# Altium project MAX14871_DC_Motor_Driver.PrjPcb (part 2 of 3)
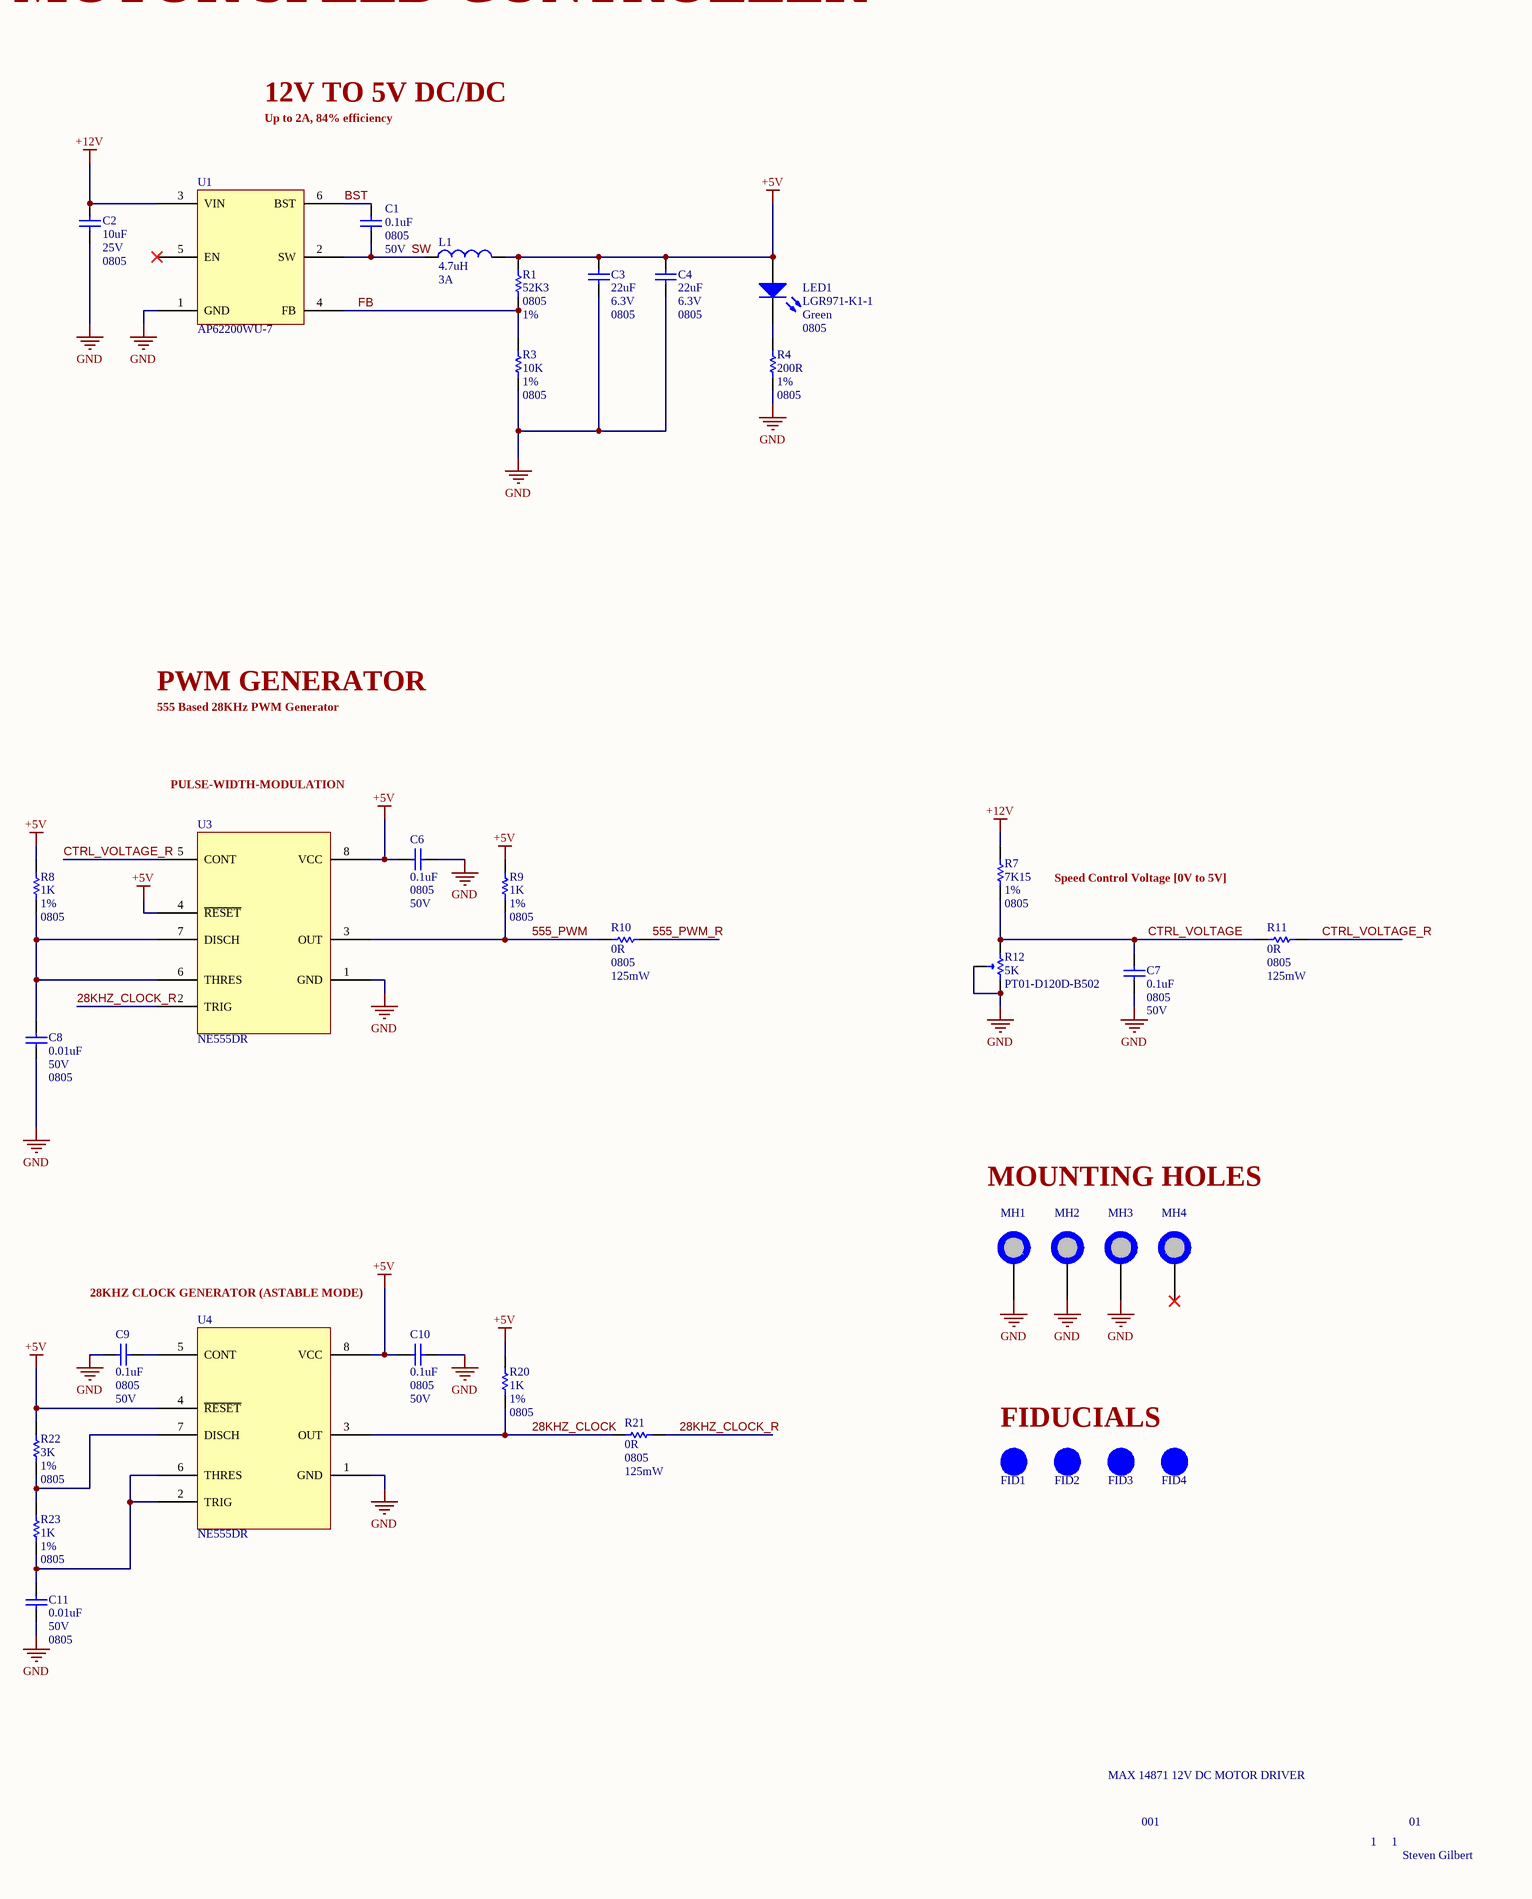
[diagram p2: 14871_Schematic.SchDoc, right]

## Sheet 14871_Schematic.SchDoc (continued)
### Library data of the parts
C1 C6 C7 C9 C10 = 08055C104KAT2A: CAP CER 0.1UF X7R 50V 0805  +/-10%; 50WVDC; SMD; 2.5% Df; 0.037IN. ,; Manufacturer: Kyocera AVX; Dielectric Material: Ceramic; Capacitance: 100nF; Tolerance: 10%; Insulation Resistance: 100GR; Supplier 1: Digi-Key; Manufacturer Part Number: 08055C104KAT2A; RoHS: Yes; Category: Ceramic Capacitors; Stock 1: 12454485; Pricing 1: 1=0.10000, 10=0.06700, 50=0.03640, 100=0.02970, 500=0.02120, 1000=0.01666 (USD); Mount: Surface Mount,PCB; Case/Package: 0805; Number of Pins: 2; Case Code (Metric): 2012; Weight: 0.001411oz; Min Operating Temperature: -55°C; Max Operating Temperature: 125°C; Dielectric: X7R; Packaging: Cut Tape; Voltage Rating: 50V; Package Quantity: 4000; Termination: Standard; Voltage: 50V; Series: MLCC X7R; Dissipation Factor: 2.5%; Length: 2mm; Width: 1.2mm; Height: 0.5mm; Depth: 1.25mm; Thickness: 0.037inch; Radiation Hardening: No; Reach SVHC Compliant: Yes; Lead Free: Lead Free; RoHS Compliant: Yes; ComponentLink1URL: https://datasheet.ciiva.com/19475/2009691-19475858.pdf?src-supplier=Jameco; ComponentLink1Description: https://datasheet.ciiva.com/19475/2009691-19475858.pdf?src-supplier=Jameco; ComponentLink2URL: https://datasheet.ciiva.com/11786/0900766b802d4698-11786116.pdf?src-supplier=RSComponents; ComponentLink2Description: https://datasheet.ciiva.com/11786/0900766b802d4698-11786116.pdf?src-supplier=RSComponents; ComponentLink3URL: https://datasheet.ciiva.com/2988/cx7r-2988014.pdf?src-supplier=Avnet; ComponentLink3Description: https://datasheet.ciiva.com/2988/cx7r-2988014.pdf?src-supplier=Avnet; ComponentLink4URL: https://datasheet.ciiva.com/16199/cx7r-16199014.pdf?src-supplier=Future+Electronics; ComponentLink4Description: https://datasheet.ciiva.com/16199/cx7r-16199014.pdf?src-supplier=Future+Electronics; ComponentLink5URL: https://datasheet.ciiva.com/11504/cx7r-11504044.pdf?src-supplier=Avnet; ComponentLink5Description: https://datasheet.ciiva.com/11504/cx7r-11504044.pdf?src-supplier=Avnet; ComponentLink6URL: https://datasheet.ciiva.com/150/cx7r-150258.pdf?src-supplier=Digi-Key; ComponentLink6Description: https://datasheet.ciiva.com/150/cx7r-150258.pdf?src-supplier=Digi-Key; ComponentLink7URL: https://datasheet.ciiva.com/150/cx7r-150257.pdf?src-supplier=Digi-Key; ComponentLink7Description: https://datasheet.ciiva.com/150/cx7r-150257.pdf?src-supplier=Digi-Key; ComponentLink8URL: https://datasheet.ciiva.com/150/cx7r-150259.pdf?src-supplier=Digi-Key; ComponentLink8Description: https://datasheet.ciiva.com/150/cx7r-150259.pdf?src-supplier=Digi-Key; ComponentLink9URL: https://datasheet.ciiva.com/7812/cx7r-7812079.pdf?src-supplier=Element14; ComponentLink9Description: https://datasheet.ciiva.com/7812/cx7r-7812079.pdf?src-supplier=Element14; ComponentLink10URL: https://datasheet.ciiva.com/5416/cx7r-5416959.pdf?src-supplier=Mouser; ComponentLink10Description: https://datasheet.ciiva.com/5416/cx7r-5416959.pdf?src-supplier=Mouser; Supplier Part Number 1: 478-1395-1-ND
C2 = GRM21BR61E106KA73L: CAP CER 10UF 25V X5R 0805; Manufacturer: Murata; Material: Ceramic; Tolerance: 10%; Supplier 1: Digi-Key; Manufacturer Part Number: GRM21BR61E106KA73L; RoHS: Yes; Category: Ceramic Capacitors; Stock 1: 4346659; Pricing 1: 1=0.25000, 10=0.17500, 50=0.11640, 100=0.09890, 500=0.06984, 1000=0.06111 (USD); Mount: Surface Mount; Case Code (Metric): 2012; Case Code (Imperial): 0805; Min Operating Temperature: -55°C; Max Operating Temperature: 85°C; Capacitance: 10uF; Dielectric: X5R; Package Quantity: 1; Voltage Rating: 25V; Packaging: Tape and Reel; Termination: SMD/SMT; Voltage: 25V; Series: GRM; Construction: Flat; Length: 2mm; Width: 0.049inch; Height: 1.25mm; Thickness: 0.053inch; Depth: 1.25mm; Radiation Hardening: No; Reach SVHC Compliant: Yes; Lead Free: Lead Free; RoHS Compliant: Yes; ComponentLink1URL: https://datasheet.ciiva.com/22774/1747469-22774396.pdf?src-supplier=Farnell; ComponentLink1Description: https://datasheet.ciiva.com/22774/1747469-22774396.pdf?src-supplier=Farnell; ComponentLink2URL: https://datasheet.ciiva.com/28584/626718-28584288.pdf?src-supplier=Element14; ComponentLink2Description: https://datasheet.ciiva.com/28584/626718-28584288.pdf?src-supplier=Element14; ComponentLink3URL: https://datasheet.ciiva.com/5424/product-5424327.pdf?src-supplier=Mouser; ComponentLink3Description: https://datasheet.ciiva.com/5424/product-5424327.pdf?src-supplier=Mouser; ComponentLink4URL: https://datasheet.ciiva.com/16440/grm21br61e106ka73l-16440627.pdf?src-supplier=Future+Electronics; ComponentLink4Description: https://datasheet.ciiva.com/16440/grm21br61e106ka73l-16440627.pdf?src-supplier=Future+Electronics; ComponentLink5URL: https://datasheet.ciiva.com/29199/454623-da-01-en-vs-kondensator-0805-29199615.pdf?src-supplier=Conrad; ComponentLink5Description: https://datasheet.ciiva.com/29199/454623-da-01-en-vs-kondensator-0805-29199615.pdf?src-supplier=Conrad; ComponentLink6URL: https://datasheet.ciiva.com/14116/grmseries-highdielectrictype-eng-14116376.pdf?src-supplier=Distrelec; ComponentLink6Description: https://datasheet.ciiva.com/14116/grmseries-highdielectrictype-eng-14116376.pdf?src-supplier=Distrelec; ComponentLink7URL: https://datasheet.ciiva.com/7719/1747469-7719093.pdf?src-supplier=Element14; ComponentLink7Description: https://datasheet.ciiva.com/7719/1747469-7719093.pdf?src-supplier=Element14; ComponentLink8URL: https://datasheet.ciiva.com/28584/626718-28584279.pdf?src-supplier=Element14; ComponentLink8Description: https://datasheet.ciiva.com/28584/626718-28584279.pdf?src-supplier=Element14; ComponentLink9URL: https://datasheet.ciiva.com/139/partnumbering-e-01-139183.pdf?src-supplier=Digi-Key; ComponentLink9Description: https://datasheet.ciiva.com/139/partnumbering-e-01-139183.pdf?src-supplier=Digi-Key; ComponentLink10URL: https://datasheet.ciiva.com/139/partnumbering-e-01-139182.pdf?src-supplier=Digi-Key; ComponentLink10Description: https://datasheet.ciiva.com/139/partnumbering-e-01-139182.pdf?src-supplier=Digi-Key; ComponentLink11URL: https://datasheet.ciiva.com/139/partnumbering-e-01-139184.pdf?src-supplier=Digi-Key; ComponentLink11Description: https://datasheet.ciiva.com/139/partnumbering-e-01-139184.pdf?src-supplier=Digi-Key; Supplier Part Number 1: 490-5523-1-ND
C3 C4 = CL21A226MQQNNNG: CAP CER 6.3V X5R 20% SMD 0805 85°C Embossed T/R; Manufacturer: Samsung; Material: Ceramic; Supplier 1: Digi-Key; Manufacturer Part Number: CL21A226MQQNNNG; RoHS: Yes; Category: Ceramic Capacitors; Stock 1: 1010294; Pricing 1: 1=0.13000, 10=0.09300, 50=0.05300, 100=0.04380, 500=0.03074, 1000=0.02545 (USD); Mount: Surface Mount; Case Code (Metric): 2012; Min Operating Temperature: -55°C; Max Operating Temperature: 85°C; Tolerance: 20%; Packaging: Tape and Reel; Package Quantity: 3000; Dielectric: X5R; Voltage: 6.3V; Series: CL; Construction: Flat; Length: 2mm; Width: 0.049inch; Height: 1.25mm; Thickness: 0.055inch; Depth: 1.25mm; Radiation Hardening: No; RoHS Compliant: Yes; ComponentLink1URL: https://datasheet.ciiva.com/25728/cl21a226mqqnnng-25728680.pdf?src-supplier=Digi-Key; ComponentLink1Description: https://datasheet.ciiva.com/25728/cl21a226mqqnnng-25728680.pdf?src-supplier=Digi-Key; ComponentLink2URL: https://datasheet.ciiva.com/29199/454647-da-01-en-vs-kondensator-0805-29199620.pdf?src-supplier=Conrad; ComponentLink2Description: https://datasheet.ciiva.com/29199/454647-da-01-en-vs-kondensator-0805-29199620.pdf?src-supplier=Conrad; Supplier Part Number 1: 1276-6460-1-ND; Capacitance: 22uF; Case Code (Imperial): 0805
C5 C12 = 0805DC105KAT2A: Cap Cer 1UF 35V X7R 0805; Manufacturer: Kyocera AVX; Supplier 1: Digi-Key; Manufacturer Part Number: 0805DC105KAT2A; RoHS: Yes; Category: Ceramic Capacitors; Stock 1: 25687; Pricing 1: 1=0.22000, 10=0.15100, 50=0.09040, 100=0.07640, 500=0.05226, 1000=0.04623 (USD); Packaging: Tape and Reel; ComponentLink1URL: http://www.mouser.com/ds/2/40/X7RDielectric-777024.pdf?src-supplier=Mouser; ComponentLink1Description: http://www.mouser.com/ds/2/40/X7RDielectric-777024.pdf?src-supplier=Mouser; Supplier Part Number 1: 478-0805DC105KAT2ACT-ND; Rating: 35V
C8 C11 = C0805C103K5RACTU: CAP CER 0.01uF 50V X7R 10% SMD 0805 125C Plastic T/R; Manufacturer: KEMET; Capacitance: 10nF; Supplier 1: Digi-Key; Manufacturer Part Number: C0805C103K5RACTU; RoHS: Yes; Category: Ceramic Capacitors; Stock 1: 3238718; Pricing 1: 1=0.11000, 10=0.07500, 50=0.04260, 100=0.03530, 500=0.02476, 1000=0.02050 (USD); Mount: Surface Mount; Case Code (Imperial): 0805; Case Code (Metric): 2012; Contact Plating: Tin,Matte; Min Operating Temperature: -55°C; Max Operating Temperature: 125°C; Tolerance: 10%; Dielectric: X7R; Packaging: Tape and Reel; Voltage Rating (DC): 50V; Package Quantity: 4000; Termination: SMD/SMT; Voltage: 50V; Construction: Flat; Length: 2mm; Width: 1.2mm; Height: 0.78mm; Depth: 1.25mm; Lead Pitch: 0.75mm; Radiation Hardening: No; ComponentLink1URL: http://www.farnell.com/datasheets/2740682.pdf?src-supplier=Farnell; ComponentLink1Description: http://www.farnell.com/datasheets/2740682.pdf?src-supplier=Farnell; ComponentLink2URL: http://www.onlinecomponents.com/productFiles/mf-KEM/kem_c1002_x7r_smd.pdf?src-supplier=Onlinecomponents.com; ComponentLink2Description: http://www.onlinecomponents.com/productFiles/mf-KEM/kem_c1002_x7r_smd.pdf?src-supplier=Onlinecomponents.com; ComponentLink3URL: https://www.verical.com/server-webapp/html/getDatasheet?partID=293414&src-supplier=Verical; ComponentLink3Description: https://www.verical.com/server-webapp/html/getDatasheet?partID=293414&src-supplier=Verical; ComponentLink4URL: http://www.farnell.com/datasheets/2740682.pdf?src-supplier=Newark; ComponentLink4Description: http://www.farnell.com/datasheets/2740682.pdf?src-supplier=Newark; ComponentLink5URL: http://www.farnell.com/datasheets/2740682.pdf?src-supplier=Element14; ComponentLink5Description: http://www.farnell.com/datasheets/2740682.pdf?src-supplier=Element14; ComponentLink6URL: https://api.kemet.com/component-edge/download/datasheet/C0805C103K5RACTU.pdf?src-supplier=Digi-Key; ComponentLink6Description: https://api.kemet.com/component-edge/download/datasheet/C0805C103K5RACTU.pdf?src-supplier=Digi-Key; ComponentLink7URL: http://www.kemet.com/Lists/ProductCatalog/Attachments/53/KEM_C1002_X7R_SMD.pdf?src-supplier=Avnet; ComponentLink7Description: http://www.kemet.com/Lists/ProductCatalog/Attachments/53/KEM_C1002_X7R_SMD.pdf?src-supplier=Avnet; Supplier Part Number 1: 399-C0805C103K5RAC7800CT-ND
D1 = BZT52C10-7-F: Vz=10V 9.4V~10.6V Izt=5mA; Manufacturer: Diodes; Max Reverse Leakage Current: 200nA; Element Configuration: Single; Output Current: 50mA; Tolerance: 6%; Forward Voltage: 900mV; Impedance: 20R; Zener Current: 5mA; ESD Protection: No; Supplier 1: Digi-Key; RoHS: Yes; Category: Zener Diodes; Stock 1: 627176; Pricing 1: 1=0.22000, 10=0.19900, 100=0.10830, 500=0.06662, 1000=0.04542 (USD); Mount: Surface Mount; Number of Pins: 2; Weight: 0.000353oz; Contact Plating: Tin,Matte; Min Operating Temperature: -65°C; Max Operating Temperature: 150°C; Packaging: Tape and Reel; Zener Voltage: 10V; Package Quantity: 3000; Series: -; Voltage Tolerance: 6%; Max Reverse Current: 200nA; Test Current: 5mA; Power Dissipation: 500mW; Working Voltage: 10V; Termination: SMD/SMT; Power Rating: 500mW; Voltage Rating (DC): 10V; Length: 2.85mm; Width: 1.7mm; Height: 1.35mm; Radiation Hardening: No; Lead Free: Lead Free; RoHS Compliant: Yes; ComponentLink1URL: https://datasheet.ciiva.com/15142/getdatasheetpartid-89980-15142547.pdf?src-supplier=Verical; ComponentLink1Description: https://datasheet.ciiva.com/15142/getdatasheetpartid-89980-15142547.pdf?src-supplier=Verical; ComponentLink2URL: https://datasheet.ciiva.com/27052/1539497-27052374.pdf?src-supplier=Jameco; ComponentLink2Description: https://datasheet.ciiva.com/27052/1539497-27052374.pdf?src-supplier=Jameco; Supplier Part Number 1: BZT52C10-FDICT-ND; Manufacturer Part Number: BZT52C10-7-F
D2 = SMF16A-TP: TVS DIODE 16VWM 26VC SOD123FL; Manufacturer: MCC; Direction: Unidirectional; Number of Unidirectional Channels: 1; Min Breakdown Voltage: 17.8V; Clamping Voltage: 26V; Peak Pulse Power: 200W; Power Line Protection: No; Max Breakdown Voltage: 19.7V; Leakage Current: 1uA; Element Configuration: Single; Peak Pulse Current: 7.7A; Diode Type: ZENER; Supplier 1: Digi-Key; Manufacturer Part Number: SMF16A-TP; RoHS: Yes; Stock 1: 30285; Pricing 1: 1=0.43000, 10=0.32600, 100=0.20330, 500=0.13910, 1000=0.10700 (USD); Mount: Surface Mount; Number of Pins: 2; Min Operating Temperature: -65°C; Max Operating Temperature: 175°C; Packaging: Tape and Reel; Package Quantity: 1; Reverse Standoff Voltage: 16V; Power Dissipation: 200W; Resistor Type: Zener; Series: -; Clamping Voltage-Max: 26V; Length: 2.85mm; Depth: 1.8mm; Radiation Hardening: No; Lead Free: Lead Free; RoHS Compliant: Yes; ComponentLink1URL: https://datasheet.ciiva.com/6574/smf5-0170sod-123fl-6574110.pdf?src-supplier=Digi-Key; ComponentLink1Description: https://datasheet.ciiva.com/6574/smf5-0170sod-123fl-6574110.pdf?src-supplier=Digi-Key; ComponentLink2URL: https://datasheet.ciiva.com/6574/smf5-0170sod-123fl-6574111.pdf?src-supplier=Digi-Key; ComponentLink2Description: https://datasheet.ciiva.com/6574/smf5-0170sod-123fl-6574111.pdf?src-supplier=Digi-Key; Supplier Part Number 1: SMF16A-TPMSCT-ND; Working Voltage: 16V
F1 = 0685T3000-01: Fuse Chip 3A 63V Slow Blow 2-Pin T/R; Manufacturer: Bel; Fuse Type: Board Mount (Cartridge Style Excluded); DC Cold Resistance: 54mR; Approvals: CE,cURus; Supplier 1: Digi-Key; Manufacturer Part Number: 0685T3000-01; RoHS: Yes; Category: Fuses; Stock 1: 409603; Pricing 1: 1=0.30000, 5=0.29600, 10=0.28200, 50=0.25180, 100=0.23450, 250=0.20848, 500=0.17372, 1000=0.16503 (USD); Mount: Surface Mount; Case Code (Imperial): 1206; Case Code (Metric): 3216; Min Operating Temperature: -55°C; Max Operating Temperature: 125°C; Packaging: Tape and Reel; Current Rating: 3A; Voltage Rating (AC): 63V; Voltage Rating (DC): 63V; RoHS Compliant: Yes; ComponentLink1URL: https://belfuse.com/resources/datasheets/circuitprotection/ds-cp-c1t-series.pdf?src-supplier=Digi-Key; ComponentLink1Description: https://belfuse.com/resources/datasheets/circuitprotection/ds-cp-c1t-series.pdf?src-supplier=Digi-Key; Supplier Part Number 1: 507-1896-1-ND
FID1-FID4 = FID_1mm: Fiducial 40mil diameter, 120 Mask
J1 J2 = 1935161: Conn PC Terminal Block 2 POS 5mm Solder ST Thru-Hole 17.5A; Manufacturer: Phoenix Contact; Number of Contacts: 2; Max Current Rating: 16A; Max Supply Voltage: 250V; Number of Levels: 1; Current: 18A; Voltage: 300V; Voltage Rating (DC): 320V; Connector Type: Screw; Wire/Cable Gauge: 26AWG; Wire Gauge (Min): 12AWG; Approvals: UL; Supplier 1: Digi-Key; Manufacturer Part Number: 1935161; RoHS: Yes; Category: Terminal Blocks; Stock 1: 238571; Pricing 1: 1=0.54000, 10=0.47200, 50=0.45100, 100=0.43870, 250=0.41000, 500=0.37720, 1000=0.36550 (USD); Mount: Through Hole; Number of Pins: 2; Contact Material: Copper,Tin; Housing Material: Polyamide; Color: Green; Weight: 0.067021oz; Material: Nylon; Housing Color: Green; Insulation Material: Nylon; Current Rating: 17.5A; Number of Rows: 1; Termination: Solder; Orientation: Straight; Voltage Rating: 250V; Package Quantity: 250; Packaging: Bulk; Number of Poles: 2; Number of Positions: 2; Number of Positions Per Level: 2; Number of Circuits: 2; Series: COMBICON PT; Number of Ways: 2; Length: 9mm; Width: 14.9mm; Height: 11.3mm; Wire Gauge (Max): 26AWG; Depth: 9mm; Pitch: 5mm; Radiation Hardening: No; RoHS Compliant: Yes; Lead Free: Lead Free; Flammability Rating: UL94 V-0; ComponentLink1URL: https://datasheet.ciiva.com/16047/1935161-16047247.pdf?src-supplier=Onlinecomponents.com; ComponentLink1Description: https://datasheet.ciiva.com/16047/1935161-16047247.pdf?src-supplier=Onlinecomponents.com; ComponentLink2URL: https://datasheet.ciiva.com/15169/getdatasheetpartid-177903-15169663.pdf?src-supplier=Verical; ComponentLink2Description: https://datasheet.ciiva.com/15169/getdatasheetpartid-177903-15169663.pdf?src-supplier=Verical; ComponentLink3URL: https://datasheet.ciiva.com/824/combiconcompact5-0mmseries-824222.pdf?src-supplier=Digi-Key; ComponentLink3Description: https://datasheet.ciiva.com/824/combiconcompact5-0mmseries-824222.pdf?src-supplier=Digi-Key; Supplier Part Number 1: 277-1667-ND
JP1 = 68000-103HLF: CONN HEADER VERT 3POS 2.54MM
L1 = NR6028T4R7M: Inductor Power Shielded Wirewound 4.7uH 20% 100KHz Ferrite 3A 0.0403Ohm DCR 2424 T/R; Manufacturer: Taiyo Yuden; Self Resonant Frequency: 39MHz; Saturation Current: 2.7A; DC Resistance (DCR): 40.3mR; Supplier 1: Digi-Key; Manufacturer Part Number: NR6028T4R7M; RoHS: Yes; Category: Fixed Inductors; Stock 1: 261825; Pricing 1: 1=0.36000, 10=0.31900, 25=0.27920, 50=0.23940, 100=0.21940, 250=0.19948, 500=0.18750, 1000=0.14362 (USD); Mount: Surface Mount; Case/Package: 2424; Number of Pins: 2; Core Material: Ferrite; Min Operating Temperature: -25°C; Max Operating Temperature: 120°C; Packaging: Tape and Reel; Tolerance: 20%; Inductance Tolerance: 20%; Package Quantity: 2000; Current Rating: 3A; Shielding: Shielded; Resistor Type: Wirewound; Inductance: 4.7uH; Test Frequency: 100kHz; Termination: SMD/SMT; RMS Current (Irms): 3A; Series: NR; Length: 0.236inch; Width: 0.236inch; Height: 2.8mm; Height - Seated (Max): 0.11inch; Depth: 6.2mm; Radiation Hardening: No; Halogen Free: Halogen Free; RoHS Compliant: Yes; Lead Free: Lead Free; ComponentLink1URL: https://datasheet.ciiva.com/7291/nr6028t4r7m-ss-7291638.pdf?src-supplier=Newark; ComponentLink1Description: https://datasheet.ciiva.com/7291/nr6028t4r7m-ss-7291638.pdf?src-supplier=Newark; ComponentLink2URL: https://datasheet.ciiva.com/8502/nr6028t4r7m-ss-8502688.pdf?src-supplier=Avnet; ComponentLink2Description: https://datasheet.ciiva.com/8502/nr6028t4r7m-ss-8502688.pdf?src-supplier=Avnet; ComponentLink3URL: https://datasheet.ciiva.com/15988/314nr6028t4r7m-15988117.pdf?src-supplier=Onlinecomponents.com; ComponentLink3Description: https://datasheet.ciiva.com/15988/314nr6028t4r7m-15988117.pdf?src-supplier=Onlinecomponents.com; ComponentLink4URL: https://datasheet.ciiva.com/1043/wound04-e-1043082.pdf?src-supplier=Digi-Key; ComponentLink4Description: https://datasheet.ciiva.com/1043/wound04-e-1043082.pdf?src-supplier=Digi-Key; ComponentLink5URL: https://datasheet.ciiva.com/1043/wound04-e-1043081.pdf?src-supplier=Digi-Key; ComponentLink5Description: https://datasheet.ciiva.com/1043/wound04-e-1043081.pdf?src-supplier=Digi-Key; ComponentLink6URL: https://datasheet.ciiva.com/1043/wound04-e-1043083.pdf?src-supplier=Digi-Key; ComponentLink6Description: https://datasheet.ciiva.com/1043/wound04-e-1043083.pdf?src-supplier=Digi-Key; ComponentLink7URL: https://datasheet.ciiva.com/4955/wound04-e-4955707.pdf?src-supplier=Mouser; ComponentLink7Description: https://datasheet.ciiva.com/4955/wound04-e-4955707.pdf?src-supplier=Mouser; Supplier Part Number 1: 587-2100-1-ND
LED1 = LGR971-K1-1: LED SMT GREEN 0805; Supplier Part Number 1: 475-1410-1-ND
LED2 = LSR976-NR-1: LED SMT RED 0805; Manufacturer: Osram Opto; Lens Color: White; Forward Current: 25mA; Forward Voltage: 2.5V; Luminous Intensity: 180mcd; Viewing Angle: 160°; Lens Style: Flat,Diffused,Colorless,Rectangular; Test Current: 20mA; Dominant Wavelength: 633nm; Luminous Flux: 0.47lm; Number of Elements: 1; Power Dissipation: 65mW; Reverse Voltage: 12V; Lens Transparency: Diffused; Lens Size: 1.25mm; Supplier 1: Mouser; Manufacturer Part Number: LSR976-NR-1; RoHS: Yes; Category: Uncategorized; Stock 1: 1195318; Pricing 1: 1=0.30000, 10=0.16400, 50=0.16400, 100=0.07700, 500=0.07100, 1000=0.05400, 5000=0.04700, 10000=0.04300, 16000=0.03700 (USD); Mount: Surface Mount; Number of Pins: 2; Color: Red; Case Code (Metric): 2012; Case Code (Imperial): 0805; Min Operating Temperature: -30°C; Max Operating Temperature: 85°C; Packaging: Tape and Reel; Package Quantity: 16000; Number of LEDs: 1; Series: CHIPLED 0805; Length: 2.1mm; Width: 1.25mm; Height: 0.9mm; Depth: 1.35mm; Radiation Hardening: No; RoHS Compliant: Yes; ComponentLink1URL: https://datasheet.ciiva.com/4688/o-ls-ly-r976-24152-4688435.pdf?src-supplier=Mouser; ComponentLink1Description: https://datasheet.ciiva.com/4688/o-ls-ly-r976-24152-4688435.pdf?src-supplier=Mouser; ComponentLink2URL: https://datasheet.ciiva.com/26920/getdatasheetpartid-568367-26920831.pdf?src-supplier=Verical; ComponentLink2Description: https://datasheet.ciiva.com/26920/getdatasheetpartid-568367-26920831.pdf?src-supplier=Verical; ComponentLink3URL: https://datasheet.ciiva.com/2112/00078896-0-2112782.pdf?src-supplier=Digi-Key; ComponentLink3Description: https://datasheet.ciiva.com/2112/00078896-0-2112782.pdf?src-supplier=Digi-Key; ComponentLink4URL: https://datasheet.ciiva.com/2112/00078896-0-2112781.pdf?src-supplier=Digi-Key; ComponentLink4Description: https://datasheet.ciiva.com/2112/00078896-0-2112781.pdf?src-supplier=Digi-Key; ComponentLink5URL: https://datasheet.ciiva.com/2112/00078896-0-2112783.pdf?src-supplier=Digi-Key; ComponentLink5Description: https://datasheet.ciiva.com/2112/00078896-0-2112783.pdf?src-supplier=Digi-Key; Supplier Part Number 1: 720-LSR976-NR-1
LINK1 = QPC02SXGN-RC: 2 Position 2.54 mm Centerline Single Circuit Open Top Jumper; Manufacturer: Sullins; Number of Positions: 2; Pitch: 0.1inch; Supplier 1: Digi-Key; Manufacturer Part Number: QPC02SXGN-RC; RoHS: Yes; Category: Connectors; Stock 1: 1015861; Pricing 1: 1=0.10000, 10=0.05000, 25=0.04080, 50=0.03780, 100=0.03650, 250=0.03152, 500=0.03024, 2000=0.02520, 4000=0.02394 (USD); Case/Package: 100; Contact Plating: Gold; Package Quantity: 2000; Packaging: Bulk; Height: 0.235inch; RoHS Compliant: Yes; Lead Free: Lead Free; ComponentLink1URL: https://datasheet.ciiva.com/767/284-sxgn-11510-767869.pdf?src-supplier=Digi-Key; ComponentLink1Description: https://datasheet.ciiva.com/767/284-sxgn-11510-767869.pdf?src-supplier=Digi-Key; Supplier Part Number 1: S9337-ND
MH1-MH3 = MH_7.4MMC_3.2MMD: Mounting Hole 7.4mm Diameter, 3.2mm Drill
MH4 = MH_7.4MMNC_3.2MMD: Hole 7.4MM Diameter (Non Copper), 3.2mm Drill NPTH
Q1 = AOD413A: MOSFET P-CH 40V 12A TO252; Manufacturer: Alpha & Omega Semiconductor; Rds On Max: 44mR; Input Capacitance: 1.125nF; Max Power Dissipation: 50W; Number of Elements: 1; Gate to Source Voltage (Vgs): 20V; Supplier 1: Digi-Key; Manufacturer Part Number: AOD413A; RoHS: Yes; Category: MOSFETs; Stock 1: 406428; Pricing 1: 1=0.61000, 10=0.54100, 100=0.41440, 500=0.32760, 1000=0.26208 (USD); Mount: Surface Mount; Number of Pins: 3; Min Operating Temperature: -55°C; Max Operating Temperature: 175°C; Package Quantity: 2500; Packaging: Tape and Reel; Drain to Source Voltage (Vdss): 40V; Lead Free: Lead Free; RoHS Compliant: Yes; ComponentLink1URL: https://datasheet.ciiva.com/6367/aod413a-6367556.pdf?src-supplier=Digi-Key; ComponentLink1Description: https://datasheet.ciiva.com/6367/aod413a-6367556.pdf?src-supplier=Digi-Key; ComponentLink2URL: https://datasheet.ciiva.com/6367/aod413a-6367558.pdf?src-supplier=Digi-Key; ComponentLink2Description: https://datasheet.ciiva.com/6367/aod413a-6367558.pdf?src-supplier=Digi-Key; ComponentLink3URL: https://datasheet.ciiva.com/6367/aod413a-6367560.pdf?src-supplier=Digi-Key; ComponentLink3Description: https://datasheet.ciiva.com/6367/aod413a-6367560.pdf?src-supplier=Digi-Key; Supplier Part Number 1: 785-1218-1-ND; Power Dissipation: 50W; Continuous Drain Current (ID): 12A; Case/Package: TO-252-3
Q2 = DMP21D0UT-7: MOSFET P-CH 20V 0.59A SOT523; Manufacturer: Diodes; Input Capacitance: 80pF; Max Power Dissipation: 240mW; Rds On Max: 495mR; Rise Time: 8ns; Continuous Drain Current (ID): 650mA; Turn-Off Delay Time: 31.7ns; Turn-On Delay Time: 7.1ns; Fall Time: 18.5ns; Element Configuration: Single; Gate to Source Voltage (Vgs): 8V; Number of Channels: 1; Polarity: P-CHANNEL; Supplier 1: Digi-Key; Manufacturer Part Number: DMP21D0UT-7; RoHS: Yes; Category: MOSFETs; Stock 1: 2029106; Pricing 1: 1=0.41000, 10=0.30900, 100=0.19230, 500=0.13156, 1000=0.10120 (USD); Mount: Surface Mount; Case/Package: SOT-523; Number of Pins: 3; Weight: 7.1E-05oz; Min Operating Temperature: -55°C; Max Operating Temperature: 150°C; Packaging: Tape and Reel; Package Quantity: 3000; Drain to Source Voltage (Vdss): 20V; Drain to Source Resistance: 495mR; Series: -; Length: 1.7mm; Width: 0.85mm; Height: 0.8mm; Radiation Hardening: No; Reach SVHC Compliant: Yes; Lead Free: Lead Free; RoHS Compliant: Yes; ComponentLink1URL: https://datasheet.ciiva.com/13055/dmp21d0ut-13055589.pdf?src-supplier=Mouser; ComponentLink1Description: https://datasheet.ciiva.com/13055/dmp21d0ut-13055589.pdf?src-supplier=Mouser; ComponentLink2URL: https://datasheet.ciiva.com/30480/0900766b8115c368-30480035.pdf?src-supplier=RSComponents; ComponentLink2Description: https://datasheet.ciiva.com/30480/0900766b8115c368-30480035.pdf?src-supplier=RSComponents; ComponentLink3URL: https://datasheet.ciiva.com/30023/dmp21d0ut-30023816.pdf?src-supplier=Avnet; ComponentLink3Description: https://datasheet.ciiva.com/30023/dmp21d0ut-30023816.pdf?src-supplier=Avnet; ComponentLink4URL: https://datasheet.ciiva.com/934/dmp21d0ut-934695.pdf?src-supplier=Digi-Key; ComponentLink4Description: https://datasheet.ciiva.com/934/dmp21d0ut-934695.pdf?src-supplier=Digi-Key; ComponentLink5URL: https://datasheet.ciiva.com/934/dmp21d0ut-934696.pdf?src-supplier=Digi-Key; ComponentLink5Description: https://datasheet.ciiva.com/934/dmp21d0ut-934696.pdf?src-supplier=Digi-Key; ComponentLink6URL: https://datasheet.ciiva.com/934/dmp21d0ut-934694.pdf?src-supplier=Digi-Key; ComponentLink6Description: https://datasheet.ciiva.com/934/dmp21d0ut-934694.pdf?src-supplier=Digi-Key; Supplier Part Number 1: DMP21D0UT-7DICT-ND
R1 = RC0805FR-0752K3L: RES SMD 52K3 OHM 1% 1/8W 0805 ±100ppm/°C SMD Paper T/R; Manufacturer: Yageo; Resistance: 52.3kR; Power Rating: 125mW; Voltage Rating: 150V; Supplier 1: Digi-Key; Manufacturer Part Number: RC0805FR-0752K3L; RoHS: Yes; Category: Chip SMD Resistors; Stock 1: 66100; Pricing 1: 1=0.10000, 10=0.03600, 100=0.01480, 1000=0.00666, 2500=0.00578 (USD); Contact Plating: Tin,Lead,Matte; Case Code (Imperial): 0805; Case Code (Metric): 2012; Size Code: 0805; Min Operating Temperature: -55°C; Max Operating Temperature: 155°C; Resistor Type: Thick Film; Temperature Coefficient: 100ppm/°C; Packaging: Tape and Reel; Package Quantity: 1; Termination: SMD/SMT; Number of Terminations: 2; Max Power Dissipation: 125mW; Voltage Rating (DC): 150V; Features: Moisture Resistant; Series: RC; Construction: Rectangular; Length: 2mm; Width: 1.25mm; Height: 0.024inch; Depth: 1.25mm; Radiation Hardening: No; Military Standard: Not; Lead Free: Lead Free; RoHS Compliant: Yes; ComponentLink1URL: https://datasheet.ciiva.com/2457/pyu-r-int-thick-7-2457498.pdf?src-supplier=Digi-Key; ComponentLink1Description: https://datasheet.ciiva.com/2457/pyu-r-int-thick-7-2457498.pdf?src-supplier=Digi-Key; ComponentLink2URL: https://datasheet.ciiva.com/2457/pyu-r-int-thick-7-2457499.pdf?src-supplier=Digi-Key; ComponentLink2Description: https://datasheet.ciiva.com/2457/pyu-r-int-thick-7-2457499.pdf?src-supplier=Digi-Key; ComponentLink3URL: https://datasheet.ciiva.com/2457/pyu-r-int-thick-7-2457497.pdf?src-supplier=Digi-Key; ComponentLink3Description: https://datasheet.ciiva.com/2457/pyu-r-int-thick-7-2457497.pdf?src-supplier=Digi-Key; Supplier Part Number 1: 311-52.3KCRCT-ND
R2 R4 R16 = RC0805FR-07200RL: RES SMD 200 OHM 1% 1/8W 0805 ±100ppm/°C; Manufacturer: Yageo; Voltage Rating (DC): 150V; Power Rating: 125mW; Supplier 1: Digi-Key; Manufacturer Part Number: RC0805FR-07200RL; RoHS: Yes; Category: Chip SMD Resistors; Stock 1: 939589; Pricing 1: 1=0.10000, 10=0.03600, 100=0.01480, 1000=0.00666, 2500=0.00578 (USD); Mount: Surface Mount; Case Code (Metric): 2012; Case Code (Imperial): 0805; Size Code: 0805; Min Operating Temperature: -55°C; Max Operating Temperature: 155°C; Resistance: 200R; Packaging: Tape and Reel; Resistor Type: Thick Film; Temperature Coefficient: 100ppm/°C; Package Quantity: 1; Voltage Rating: 150V; Number of Terminations: 2; Termination: SMD/SMT; Max Power Dissipation: 125mW; Features: Moisture Resistant; Series: RC; Construction: Rectangular; Length: 2mm; Width: 0.049inch; Height: 0.024inch; Depth: 1.25mm; Lead Free: Lead Free; Military Standard: Not; RoHS Compliant: Yes; ComponentLink1URL: https://datasheet.ciiva.com/2519/pyu-r-int-thick-7-2519721.pdf?src-supplier=Digi-Key; ComponentLink1Description: https://datasheet.ciiva.com/2519/pyu-r-int-thick-7-2519721.pdf?src-supplier=Digi-Key; ComponentLink2URL: https://datasheet.ciiva.com/2519/pyu-r-int-thick-7-2519722.pdf?src-supplier=Digi-Key; ComponentLink2Description: https://datasheet.ciiva.com/2519/pyu-r-int-thick-7-2519722.pdf?src-supplier=Digi-Key; ComponentLink3URL: https://datasheet.ciiva.com/2519/pyu-r-int-thick-7-2519720.pdf?src-supplier=Digi-Key; ComponentLink3Description: https://datasheet.ciiva.com/2519/pyu-r-int-thick-7-2519720.pdf?src-supplier=Digi-Key; ComponentLink4URL: https://datasheet.ciiva.com/12667/rc0805-12667066.pdf?src-supplier=Mouser; ComponentLink4Description: https://datasheet.ciiva.com/12667/rc0805-12667066.pdf?src-supplier=Mouser; ComponentLink5URL: https://datasheet.ciiva.com/15189/getdatasheetpartid-327982-15189926.pdf?src-supplier=Verical; ComponentLink5Description: https://datasheet.ciiva.com/15189/getdatasheetpartid-327982-15189926.pdf?src-supplier=Verical; Supplier Part Number 1: 311-200CRCT-ND
R3 = RC0805FR-0710KL: RES SMD 10K OHM 1% 1/8W  0805 Thick Film+/-100ppm/C Epoxy Pad SMD T/R; Manufacturer: Yageo; Resistance: 10kR; Power Rating: 125mW; Voltage Rating: 150V; Temperature Coefficient: 100ppm/°C; Supplier 1: Digi-Key; Manufacturer Part Number: RC0805FR-0710KL; RoHS: Yes; Category: Chip SMD Resistors; Stock 1: 11341268; Pricing 1: 1=0.10000, 10=0.03700, 100=0.01490, 1000=0.00669, 2500=0.00581 (USD); Case Code (Imperial): 0805; Case Code (Metric): 2012; Size Code: 0805; Min Operating Temperature: -55°C; Max Operating Temperature: 155°C; Packaging: Tape and Reel; Package Quantity: 1; Termination: SMD/SMT; Resistor Type: Thick Film; Number of Terminations: 2; Max Power Dissipation: 125mW; Features: Moisture Resistant; Series: RC; Construction: Rectangular; Resistance Tolerance: 1%; Technology: THICK FILM; Length: 0.079inch; Width: 0.049inch; Height: 0.024inch; Depth: 1.25mm; Military Standard: Not; Lead Free: Lead Free; RoHS Compliant: Yes; ComponentLink1URL: https://datasheet.ciiva.com/11808/0900766b8106beab-11808151.pdf?src-supplier=RSComponents; ComponentLink1Description: https://datasheet.ciiva.com/11808/0900766b8106beab-11808151.pdf?src-supplier=RSComponents; ComponentLink2URL: https://datasheet.ciiva.com/46447/444164-46447563.pdf?src-supplier=Element14; ComponentLink2Description: https://datasheet.ciiva.com/46447/444164-46447563.pdf?src-supplier=Element14; ComponentLink3URL: https://datasheet.ciiva.com/2456/pyu-r-int-thick-7-2456973.pdf?src-supplier=Digi-Key; ComponentLink3Description: https://datasheet.ciiva.com/2456/pyu-r-int-thick-7-2456973.pdf?src-supplier=Digi-Key; ComponentLink4URL: https://datasheet.ciiva.com/2456/pyu-r-int-thick-7-2456974.pdf?src-supplier=Digi-Key; ComponentLink4Description: https://datasheet.ciiva.com/2456/pyu-r-int-thick-7-2456974.pdf?src-supplier=Digi-Key; ComponentLink5URL: https://datasheet.ciiva.com/2456/pyu-r-int-thick-7-2456972.pdf?src-supplier=Digi-Key; ComponentLink5Description: https://datasheet.ciiva.com/2456/pyu-r-int-thick-7-2456972.pdf?src-supplier=Digi-Key; ComponentLink6URL: https://datasheet.ciiva.com/12669/rc0805-12669688.pdf?src-supplier=Mouser; ComponentLink6Description: https://datasheet.ciiva.com/12669/rc0805-12669688.pdf?src-supplier=Mouser; ComponentLink7URL: https://datasheet.ciiva.com/16747/rc0805-16747087.pdf?src-supplier=Future+Electronics; ComponentLink7Description: https://datasheet.ciiva.com/16747/rc0805-16747087.pdf?src-supplier=Future+Electronics; Supplier Part Number 1: 311-10.0KCRCT-ND
R5 = RMCF2010ZT0R00: Res Thick Film 2010 0 Ohm Molded SMD Automotive Plastic T/R; Manufacturer: Stackpole Electronics; Supplier 1: Digi-Key; Manufacturer Part Number: RMCF2010ZT0R00; RoHS: Yes; Category: Chip SMD Resistors; Stock 1: 436684; Pricing 1: 1=0.20000, 10=0.16700, 25=0.12120, 50=0.08780, 100=0.06510, 250=0.05000, 500=0.03940, 1000=0.02727 (USD); Mount: Surface Mount; Case Code (Metric): 5025; Case Code (Imperial): 2010; Contact Plating: Tin,Matte; Size Code: 2010; Min Operating Temperature: -55°C; Max Operating Temperature: 155°C; Packaging: Tape and Reel; Resistor Type: Thick Film; Number of Terminations: 2; Max Power Dissipation: 750mW; Features: Automotive AEC-Q200; Series: RMCF; Construction: Rectangular; Length: 0.197inch; Width: 0.098inch; Height: 0.028inch; Depth: 2.5mm; Radiation Hardening: No; Military Standard: Not; Lead Free: Lead Free; RoHS Compliant: Yes; ComponentLink1URL: http://components.arrow.com/part/dataview/55788137S308674N1174?src-supplier=Arrow+Electronics; ComponentLink1Description: http://components.arrow.com/part/dataview/55788137S308674N1174?src-supplier=Arrow+Electronics; ComponentLink2URL: https://www.seielect.com/catalog/SEI-Packaging.pdf?src-supplier=Digi-Key; ComponentLink2Description: https://www.seielect.com/catalog/SEI-Packaging.pdf?src-supplier=Digi-Key; ComponentLink3URL: https://www.seielect.com/Catalog/SEI-RMCF_RMCP.pdf?src-supplier=Digi-Key; ComponentLink3Description: https://www.seielect.com/Catalog/SEI-RMCF_RMCP.pdf?src-supplier=Digi-Key; ComponentLink4URL: https://www.seielect.com/catalog/SEI-RMCF_RMCP.pdf?src-supplier=Avnet; ComponentLink4Description: https://www.seielect.com/catalog/SEI-RMCF_RMCP.pdf?src-supplier=Avnet; ComponentLink5URL: http://www.seielect.com/Catalog/SEI-RMC.pdf?src-supplier=Future+Electronics; ComponentLink5Description: http://www.seielect.com/Catalog/SEI-RMC.pdf?src-supplier=Future+Electronics; ComponentLink6URL: https://www.verical.com/server-webapp/html/getDatasheet?partID=691632&src-supplier=Verical; ComponentLink6Description: https://www.verical.com/server-webapp/html/getDatasheet?partID=691632&src-supplier=Verical; Supplier Part Number 1: RMCF2010ZT0R00CT-ND; Resistance: 0R
R6 R8 R9 R13 R15 R19 R20 R23 = RC0805FR-071KL: RES SMD 1K OHM 1% 1/8W 0805; Manufacturer: Yageo; Resistance: 1kR; Temperature Coefficient: 100ppm/°C; Voltage Rating (DC): 150V; Power Rating: 125mW; Supplier 1: Digi-Key; Manufacturer Part Number: RC0805FR-071KL; RoHS: Yes; Category: Chip SMD Resistors; Stock 1: 9084773; Pricing 1: 1=0.10000, 10=0.03600, 100=0.01480, 1000=0.00666, 2500=0.00578 (USD); Number of Pins: 2; Case Code (Metric): 2012; Size Code: 0805; Min Operating Temperature: -55°C; Max Operating Temperature: 155°C; Resistor Type: Thick Film; Packaging: Tape and Reel; Package Quantity: 1; Voltage Rating: 150V; Number of Terminations: 2; Termination: SMD/SMT; Max Power Dissipation: 125mW; Features: Moisture Resistant; Series: RC; Resistance Tolerance: 1%; Construction: Rectangular; Length: 0.079inch; Width: 0.049inch; Height: 0.024inch; Depth: 1.25mm; Reach SVHC Compliant: Yes; Lead Free: Lead Free; RoHS Compliant: Yes; Military Standard: Not; ComponentLink1URL: https://datasheet.ciiva.com/7941/1686128-7941719.pdf?src-supplier=Element14; ComponentLink1Description: https://datasheet.ciiva.com/7941/1686128-7941719.pdf?src-supplier=Element14; ComponentLink2URL: https://datasheet.ciiva.com/46385/444164-46385020.pdf?src-supplier=Element14; ComponentLink2Description: https://datasheet.ciiva.com/46385/444164-46385020.pdf?src-supplier=Element14; ComponentLink3URL: https://datasheet.ciiva.com/2456/pyu-r-int-thick-7-2456976.pdf?src-supplier=Digi-Key; ComponentLink3Description: https://datasheet.ciiva.com/2456/pyu-r-int-thick-7-2456976.pdf?src-supplier=Digi-Key; ComponentLink4URL: https://datasheet.ciiva.com/2456/pyu-r-int-thick-7-2456977.pdf?src-supplier=Digi-Key; ComponentLink4Description: https://datasheet.ciiva.com/2456/pyu-r-int-thick-7-2456977.pdf?src-supplier=Digi-Key; ComponentLink5URL: https://datasheet.ciiva.com/2456/pyu-r-int-thick-7-2456975.pdf?src-supplier=Digi-Key; ComponentLink5Description: https://datasheet.ciiva.com/2456/pyu-r-int-thick-7-2456975.pdf?src-supplier=Digi-Key; ComponentLink6URL: https://datasheet.ciiva.com/16850/rc0805-16850409.pdf?src-supplier=Future+Electronics; ComponentLink6Description: https://datasheet.ciiva.com/16850/rc0805-16850409.pdf?src-supplier=Future+Electronics; Supplier Part Number 1: 311-1.00KCRCT-ND; Case Code (Imperial): 0805
R7 = RC0805FR-077K15L: RES SMD 7K15 OHM 1% 1/8W 0805 Thick Film 2.0 x 1.2 mm 100ppm/ C Molded SMD Paper T/R; Manufacturer: Yageo; Resistance: 7.15kR; Temperature Coefficient: 100ppm/°C; Power Rating: 125mW; Voltage Rating: 150V; Supplier 1: Digi-Key; Manufacturer Part Number: RC0805FR-077K15L; RoHS: Yes; Category: Chip SMD Resistors; Stock 1: 115604; Pricing 1: 1=0.10000, 10=0.03600, 100=0.01480, 1000=0.00666, 2500=0.00578 (USD); Contact Plating: Tin,Matte,Lead; Case Code (Metric): 2012; Weight: 0.000194oz; Size Code: 0805; Min Operating Temperature: -55°C; Max Operating Temperature: 155°C; Resistor Type: Thick Film; Packaging: Tape and Reel; Package Quantity: 1; Termination: SMD/SMT; Number of Terminations: 2; Max Power Dissipation: 125mW; Voltage Rating (DC): 150V; Features: Moisture Resistant; Series: RC; Construction: Rectangular; Length: 2mm; Width: 1.25mm; Height: 0.024inch; Depth: 1.25mm; Radiation Hardening: No; Military Standard: Not; Lead Free: Lead Free; RoHS Compliant: Yes; ComponentLink1URL: https://datasheet.ciiva.com/2509/pyu-r-int-thick-7-2509532.pdf?src-supplier=Digi-Key; ComponentLink1Description: https://datasheet.ciiva.com/2509/pyu-r-int-thick-7-2509532.pdf?src-supplier=Digi-Key; ComponentLink2URL: https://datasheet.ciiva.com/2509/pyu-r-int-thick-7-2509533.pdf?src-supplier=Digi-Key; ComponentLink2Description: https://datasheet.ciiva.com/2509/pyu-r-int-thick-7-2509533.pdf?src-supplier=Digi-Key; ComponentLink3URL: https://datasheet.ciiva.com/2509/pyu-r-int-thick-7-2509531.pdf?src-supplier=Digi-Key; ComponentLink3Description: https://datasheet.ciiva.com/2509/pyu-r-int-thick-7-2509531.pdf?src-supplier=Digi-Key; ComponentLink4URL: https://datasheet.ciiva.com/5561/rc0805-5561850.pdf?src-supplier=Mouser; ComponentLink4Description: https://datasheet.ciiva.com/5561/rc0805-5561850.pdf?src-supplier=Mouser; ComponentLink5URL: https://datasheet.ciiva.com/17053/rc0805-17053637.pdf?src-supplier=Future+Electronics; ComponentLink5Description: https://datasheet.ciiva.com/17053/rc0805-17053637.pdf?src-supplier=Future+Electronics; Supplier Part Number 1: 311-7.15KCRCT-ND; Case Code (Imperial): 0805
R10 R11 R21 = RC0805JR-070RL: JUMPER SMD 0 OHM 150V 1/8W 0805; Manufacturer: Yageo; Resistance: 0mR; Tolerance: 5%; Temperature Coefficient: 200ppm/°C; Supplier 1: Digi-Key; Manufacturer Part Number: RC0805JR-070RL; RoHS: Yes; Category: Chip SMD Resistors; Stock 1: 5377250; Pricing 1: 1=0.10000, 10=0.03100, 25=0.02280, 50=0.01720, 100=0.01280, 250=0.00972, 500=0.00778, 1000=0.00573 (USD); Number of Pins: 2; Contact Plating: Tin,Matte; Case Code (Metric): 2012; Size Code: 0805; Min Operating Temperature: -55°C; Max Operating Temperature: 155°C; Resistor Type: Thick Film; Power Rating: 125mW; Packaging: Tape and Reel; Voltage Rating: 150V; Voltage Rating (DC): 150V; Termination: SMD/SMT; Features: Moisture Resistant; Series: RC; Number of Terminations: 2; Construction: Rectangular; Technology: THICK FILM; Resistance Tolerance: 5%; Length: 2mm; Width: 1.25mm; Height: 0.5mm; Depth: 1.25mm; Radiation Hardening: No; RoHS Compliant: Yes; Military Standard: Not; Lead Free: Lead Free; ComponentLink1URL: https://datasheet.ciiva.com/11819/0900766b8106beab-11819430.pdf?src-supplier=RSComponents; ComponentLink1Description: https://datasheet.ciiva.com/11819/0900766b8106beab-11819430.pdf?src-supplier=RSComponents; ComponentLink2URL: https://datasheet.ciiva.com/7941/1738694-7941861.pdf?src-supplier=Element14; ComponentLink2Description: https://datasheet.ciiva.com/7941/1738694-7941861.pdf?src-supplier=Element14; ComponentLink3URL: https://datasheet.ciiva.com/7941/1738694-7941862.pdf?src-supplier=Element14; ComponentLink3Description: https://datasheet.ciiva.com/7941/1738694-7941862.pdf?src-supplier=Element14; ComponentLink4URL: https://datasheet.ciiva.com/7941/1738694-7941863.pdf?src-supplier=Element14; ComponentLink4Description: https://datasheet.ciiva.com/7941/1738694-7941863.pdf?src-supplier=Element14; ComponentLink5URL: https://datasheet.ciiva.com/15190/getdatasheetpartid-330685-15190028.pdf?src-supplier=Verical; ComponentLink5Description: https://datasheet.ciiva.com/15190/getdatasheetpartid-330685-15190028.pdf?src-supplier=Verical; Supplier Part Number 1: 311-0.0ARCT-ND; Case Code (Imperial): 0805
R12 = PT01-D120D-B502: POT 5K OHM Panel Mount/Through Hole, Rotary Potentiometer; Manufacturer: CUI Devices; Supplier 1: DigiKey; Stock 1: 984; Pricing 1: 1=0.79000, 10=0.66600, 25=0.61720, 50=0.58200, 100=0.54700, 250=0.47200, 1000=0.44100, 2500=0.41800 (USD); ComponentLink1URL: https://datasheet.octopart.com/PT01-D120D-B502-CUI-Devices-datasheet-158883457.pdf?src-supplier=CUI+Devices; ComponentLink1Description: https://datasheet.octopart.com/PT01-D120D-B502-CUI-Devices-datasheet-158883457.pdf?src-supplier=CUI+Devices; Supplier Part Number 1: 2223-PT01-D120D-B502-ND; Manufacturer Part Number: PT01-D120D-B502
R14 = RC0805JR-075K6L: RES SMD 5K6 OHM 5% 1/8W 0805  Thick Film ±100ppm/C Pad SMD T/R; Manufacturer: Yageo; Resistance: 5.6kR; Temperature Coefficient: 100ppm/°C; Power Rating: 125mW; Voltage Rating: 150V; Supplier 1: Digi-Key; Manufacturer Part Number: RC0805JR-075K6L; RoHS: Yes; Category: Chip SMD Resistors; Stock 1: 166799; Pricing 1: 1=0.100000, 10=0.032000, 100=0.013000, 1000=0.005840, 2500=0.005070 (USD); Contact Plating: Tin,Lead; Case Code (Metric): 2012; Case Code (Imperial): 0805; Size Code: 0805; Min Operating Temperature: -55°C; Max Operating Temperature: 155°C; Tolerance: 5%; Resistor Type: Thick Film; Package Quantity: 5000; Packaging: Tape and Reel; Number of Terminations: 2; Termination: SMD/SMT; Max Power Dissipation: 125mW; Features: Moisture Resistant; Series: RC; Construction: Rectangular; Length: 2mm; Width: 1.25mm; Height: 0.5mm; Depth: 1.25mm; Radiation Hardening: No; RoHS Compliant: Yes; Military Standard: Not; Lead Free: Lead Free; ComponentLink1URL: https://datasheet.ciiva.com/2519/pyu-r-int-thick-7-2519283.pdf?src-supplier=Digi-Key; ComponentLink1Description: https://datasheet.ciiva.com/2519/pyu-r-int-thick-7-2519283.pdf?src-supplier=Digi-Key; ComponentLink2URL: https://datasheet.ciiva.com/2519/pyu-r-int-thick-7-2519284.pdf?src-supplier=Digi-Key; ComponentLink2Description: https://datasheet.ciiva.com/2519/pyu-r-int-thick-7-2519284.pdf?src-supplier=Digi-Key; ComponentLink3URL: https://datasheet.ciiva.com/2519/pyu-r-int-thick-7-2519282.pdf?src-supplier=Digi-Key; ComponentLink3Description: https://datasheet.ciiva.com/2519/pyu-r-int-thick-7-2519282.pdf?src-supplier=Digi-Key; ComponentLink4URL: https://datasheet.ciiva.com/15190/getdatasheetpartid-348583-15190060.pdf?src-supplier=Verical; ComponentLink4Description: https://datasheet.ciiva.com/15190/getdatasheetpartid-348583-15190060.pdf?src-supplier=Verical; ComponentLink5URL: https://datasheet.ciiva.com/17086/rc0805-17086095.pdf?src-supplier=Future+Electronics; ComponentLink5Description: https://datasheet.ciiva.com/17086/rc0805-17086095.pdf?src-supplier=Future+Electronics; Supplier Part Number 1: 311-5.6KARCT-ND
R17 = RC0805FR-074K02L: RES SMD 4K02 OHM 1% 1/8W 0805 Thick Film 2.0 x 1.2 mm 100ppm/ C Molded SMD Paper T/R; Manufacturer: Yageo; Power Rating: 125mW; Resistance: 4.02kR; Voltage Rating: 150V; Temperature Coefficient: 100ppm/°C; Supplier 1: Digi-Key; Manufacturer Part Number: RC0805FR-074K02L; RoHS: Yes; Category: Chip SMD Resistors; Stock 1: 404687; Pricing 1: 1=0.10000, 10=0.03600, 100=0.01480, 1000=0.00666, 2500=0.00578 (USD); Mount: Surface Mount; Case Code (Imperial): 0805; Case Code (Metric): 2012; Size Code: 0805; Min Operating Temperature: -55°C; Max Operating Temperature: 155°C; Packaging: Tape and Reel; Termination: SMD/SMT; Resistor Type: Thick Film; Voltage Rating (DC): 150V; Features: Moisture Resistant; Series: RC; Max Power Dissipation: 125mW; Number of Terminations: 2; Technology: THICK FILM; Construction: Rectangular; Length: 2mm; Height: 0.5mm; Depth: 1.25mm; Military Standard: Not; Lead Free: Lead Free; RoHS Compliant: Yes; ComponentLink1URL: https://datasheet.ciiva.com/11808/0900766b8106beab-11808579.pdf?src-supplier=RSComponents; ComponentLink1Description: https://datasheet.ciiva.com/11808/0900766b8106beab-11808579.pdf?src-supplier=RSComponents; ComponentLink2URL: https://datasheet.ciiva.com/12667/rc0805-12667015.pdf?src-supplier=Mouser; ComponentLink2Description: https://datasheet.ciiva.com/12667/rc0805-12667015.pdf?src-supplier=Mouser; ComponentLink3URL: https://datasheet.ciiva.com/15189/getdatasheetpartid-342839-15189978.pdf?src-supplier=Verical; ComponentLink3Description: https://datasheet.ciiva.com/15189/getdatasheetpartid-342839-15189978.pdf?src-supplier=Verical; ComponentLink4URL: https://datasheet.ciiva.com/16771/rc0805-16771996.pdf?src-supplier=Future+Electronics; ComponentLink4Description: https://datasheet.ciiva.com/16771/rc0805-16771996.pdf?src-supplier=Future+Electronics; Supplier Part Number 1: 311-4.02KCRCT-ND
R18 = VSRP1206S1-R100F: RES SENSE SMD 0R1 OHM 1% 1W 1206; Manufacturer: Cyntec; Supplier 1: Digi-Key; Manufacturer Part Number: VSRP1206S1-R100F; RoHS: Yes; Category: Chip SMD Resistors; Stock 1: 23192; Pricing 1: 1=0.57000, 10=0.47700, 25=0.40920, 50=0.36820, 100=0.32040, 250=0.28632, 500=0.23180, 1000=0.18748 (USD); Supplier Part Number 1: 2037-VSRP1206S1-R100FCT-ND
R22 = RC0805FR-073KL: RES SMD 3K OHM 1% 1/8W 0805 Thick Film ±100ppm/C Pad SMD T/R; Manufacturer: Yageo; Resistance: 3kR; Temperature Coefficient: 100ppm/°C; Voltage Rating (DC): 150V; Power Rating: 125mW; Supplier 1: Digi-Key; Manufacturer Part Number: RC0805FR-073KL; RoHS: Yes; Category: Chip SMD Resistors; Stock 1: 518249; Pricing 1: 1=0.10000, 10=0.03600, 100=0.01480, 1000=0.00666, 2500=0.00578 (USD); Mount: Surface Mount; Case Code (Metric): 2012; Case Code (Imperial): 0805; Size Code: 0805; Min Operating Temperature: -55°C; Max Operating Temperature: 155°C; Resistor Type: Thick Film; Packaging: Tape and Reel; Package Quantity: 1; Voltage Rating: 150V; Number of Terminations: 2; Termination: SMD/SMT; Max Power Dissipation: 125mW; Features: Moisture Resistant; Series: RC; Construction: Rectangular; Length: 2mm; Width: 0.049inch; Height: 0.024inch; Depth: 1.25mm; Lead Free: Lead Free; Military Standard: Not; RoHS Compliant: Yes; ComponentLink1URL: https://datasheet.ciiva.com/2457/pyu-r-int-thick-7-2457135.pdf?src-supplier=Digi-Key; ComponentLink1Description: https://datasheet.ciiva.com/2457/pyu-r-int-thick-7-2457135.pdf?src-supplier=Digi-Key; ComponentLink2URL: https://datasheet.ciiva.com/2457/pyu-r-int-thick-7-2457136.pdf?src-supplier=Digi-Key; ComponentLink2Description: https://datasheet.ciiva.com/2457/pyu-r-int-thick-7-2457136.pdf?src-supplier=Digi-Key; ComponentLink3URL: https://datasheet.ciiva.com/2457/pyu-r-int-thick-7-2457134.pdf?src-supplier=Digi-Key; ComponentLink3Description: https://datasheet.ciiva.com/2457/pyu-r-int-thick-7-2457134.pdf?src-supplier=Digi-Key; ComponentLink4URL: https://datasheet.ciiva.com/5558/rc0805-5558124.pdf?src-supplier=Mouser; ComponentLink4Description: https://datasheet.ciiva.com/5558/rc0805-5558124.pdf?src-supplier=Mouser; ComponentLink5URL: https://datasheet.ciiva.com/17043/rc0805-17043750.pdf?src-supplier=Future+Electronics; ComponentLink5Description: https://datasheet.ciiva.com/17043/rc0805-17043750.pdf?src-supplier=Future+Electronics; Supplier Part Number 1: 311-3.00KCRCT-ND
U1 = AP62200WU-7: 4.2V to 18V Input 2A Low IQ Synchronous Buck Converter 6-Pin TSOT-26 T/R; Manufacturer: Diodes; Supplier 1: Digi-Key; RoHS: Yes; Category: Voltage Regulators - Switching; Stock 1: 508009; Pricing 1: 1=0.43000, 10=0.37100, 25=0.34600, 100=0.27690, 250=0.25712, 500=0.21758, 1000=0.16813 (USD); RoHS Compliant: Yes; Supplier Part Number 1: 31-AP62200WU-7CT-ND; Manufacturer Part Number: AP62200WU-7
U2 = MAX14871EUE+T: IC Motor Driver 4.5V-36V 16TSSOP; Manufacturer: Analog Devices; Supplier 1: Digi-Key; Manufacturer Part Number: MAX14871EUE+T; RoHS: No; Category: Uncategorized; Stock 1: 2369; Pricing 1: 1=5.19000, 10=4.66500, 25=4.41000, 100=3.82200, 250=3.62600, 500=3.25360, 1000=2.94000 (USD); Supplier Part Number 1: MAX14871EUE+CT-ND